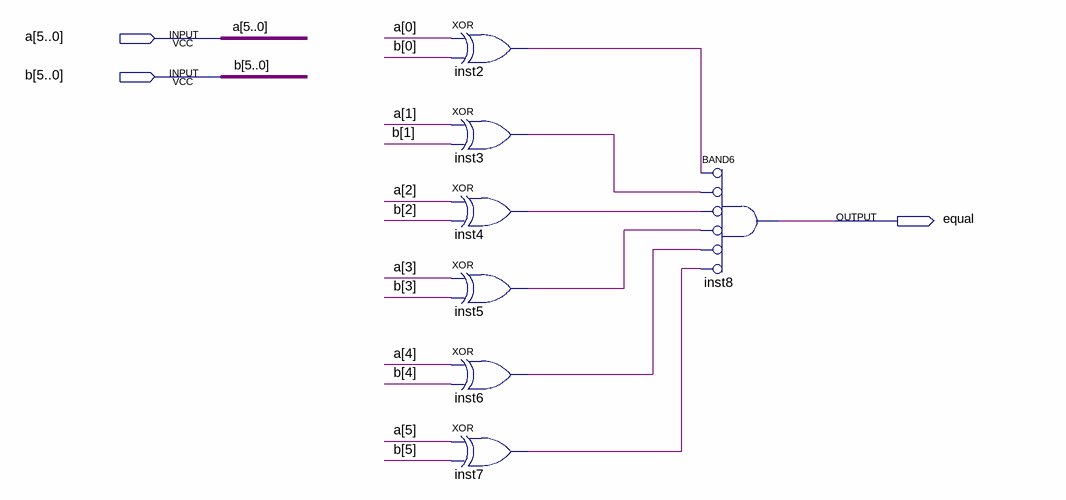
[diagram p0: schematic sheet]
// Quartus schematic comp_6b.bdf as structural Verilog: 7 symbols, 3 pins
module comp_6b (
  input  [5:0] a,
  input  [5:0] b,
  output equal
);

  wire inst2_out, inst3_out, inst4_out, inst5_out, inst6_out, inst7_out;

  xor inst2 (inst2_out, a[0], b[0]);
  xor inst3 (inst3_out, a[1], b[1]);
  xor inst4 (inst4_out, a[2], b[2]);
  xor inst5 (inst5_out, a[3], b[3]);
  xor inst6 (inst6_out, a[4], b[4]);
  xor inst7 (inst7_out, a[5], b[5]);
  and inst8 (equal, ~inst2_out, ~inst3_out, ~inst4_out, ~inst5_out, ~inst6_out, ~inst7_out);  // BAND6
endmodule
